# EasyEDA Pro project ProDoc_Eprobe_V3_1.epro, board 便携式电化学工作站V3_1
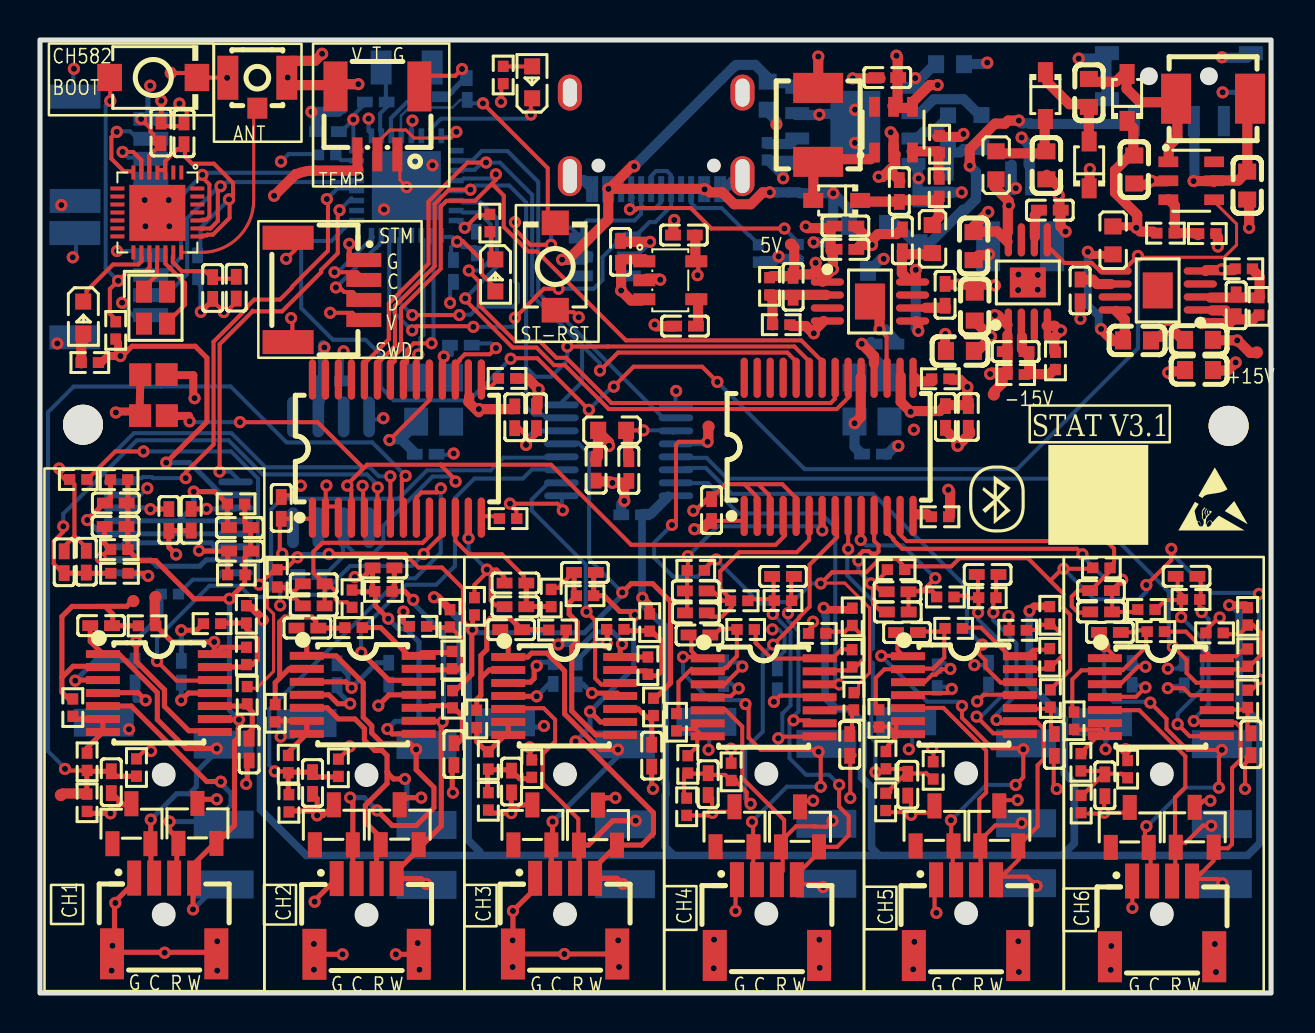
[diagram p6: board, top side]
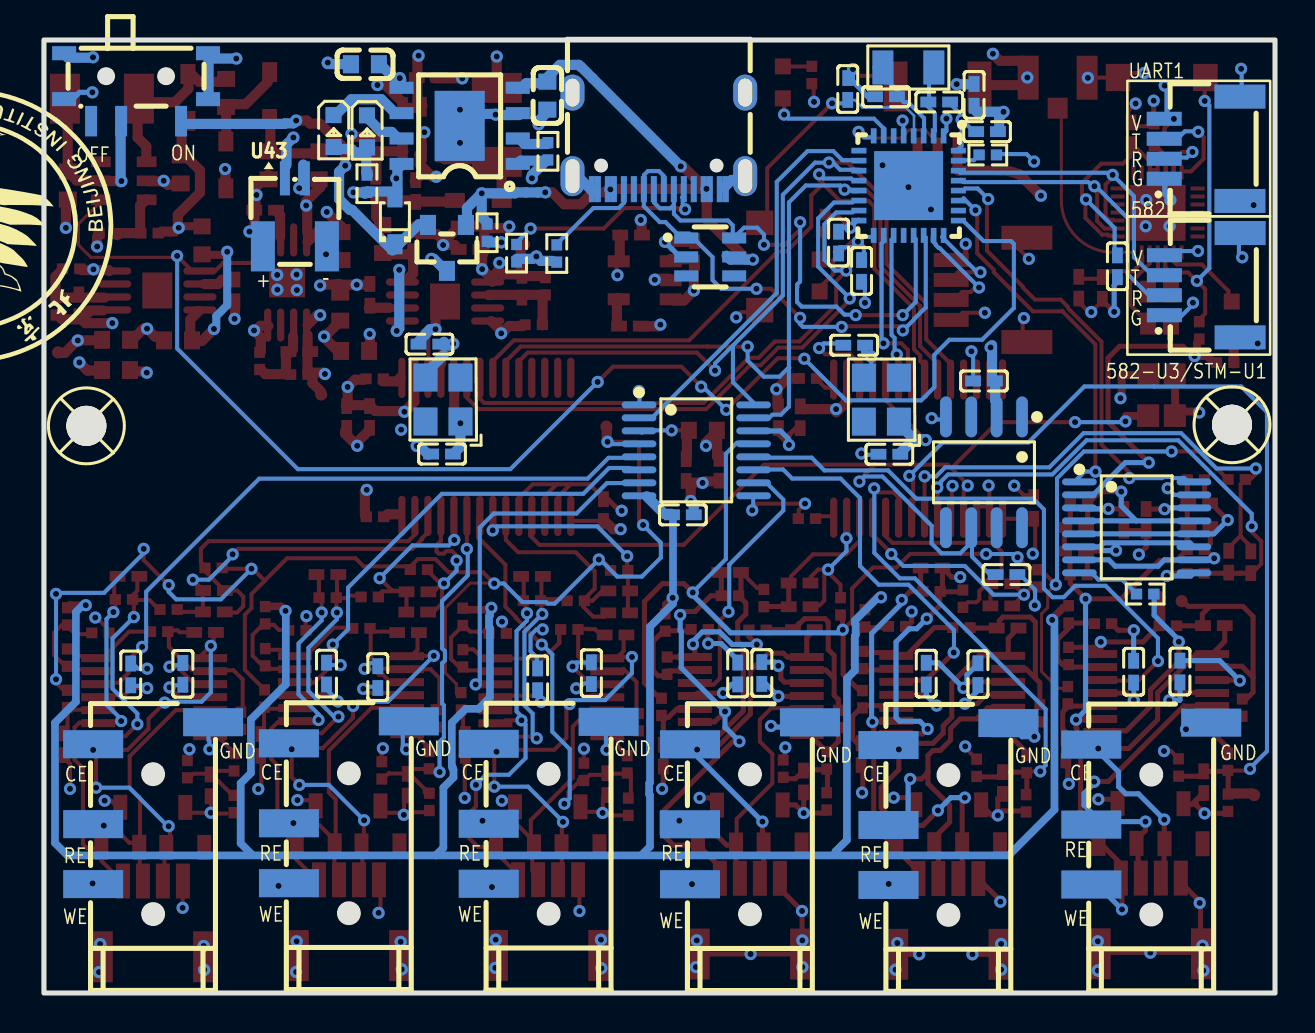
[diagram p7: board, bottom side, seen from below]

Outline 61.6 x 47.68 mm; copper layers: Top Layer, Inner1, Inner2, Bottom Layer. Coordinates in mm from the lower left corner of the outline.
Outline path: rectangle 0,47.68 61.6,0
Stack: Top Layer 0.035mm 外层铜厚1oz / Dielectric1 0.2104mm 7628 RC49% 8.6mil / Inner1 0.0152mm 内层铜厚 / Dielectric2 1.065mm 1.1mm H/HOZ Copper / Inner2 0.0152mm 内层铜厚 / Dielectric3 0.2104mm 7628 RC49% 8.6mil / Bottom Layer 0.035mm 外层铜厚1oz

## Design rules (mm)
net USB_DP: DP1
net USB_DM: DP1
net ADC2_AIN0: ADC2-3
net ADC2_AIN1: ADC2-3
net ADC2_AIN4: ADC2-2
net ADC2_AIN5: ADC2-2
net ADC2_AIN6: ADC2-1
net ADC2_AIN7: ADC2-1
net ADC1_AIN0: ADC1-3
net ADC1_AIN1: ADC1-3
net ADC1_AIN4: ADC1-2
net ADC1_AIN5: ADC1-2
net ADC1_AIN6: ADC1-1
net ADC1_AIN7: ADC1-1
template: JLCPCB Capability(Two Layers Board)
spacing copperThickness1oz (default): track to track 0.102, other pairs 0.152 to 0.3
spacing copperThickness2oz: track to track 0.203, other pairs 0.152 to 0.3
track width copperThickness1oz (default): min 0.127, default 0.254, max 2.54
track width copperThickness2oz: min 0.203, default 0.254, max 2.54
differential pair differentialPair (default): width min 0.127, default 0.254, max 2.54; gap min 0.152, default 0.152
via viaSize (default): diameter min 0.5, default 0.61, max 10; hole min 0.3, default 0.305, max 6.3

## Placement (name value [footprint] x y rotation side)
C1  2.2uF  [C0402]  7.89 36.36 90 bottom
C2  100nF  [C0402]  6.05 43.05 270 top
C3  100nF  [C0402]  7.21 43.02 90 top
C4  100nF  [C0402]  8.64 35.28 270 top
C5  2.2uF  [C0402]  9.82 35.29 270 top
C14  10nF  [C0402]  10.01 22.11 0 top
C15  22nF  [C0402]  3.79 24.52 0 top
C16  100nF  [C0402]  10 23.29 0 top
C17  10uF  [C0402]  27.82 26.18 90 top
C18  1uF  [C0402]  29.46 26.17 90 top
C19  220nF  [C0402]  29.63 23.93 0 bottom
C20  100nF  [C0402]  12.07 24.27 270 top
C21  33nF  [C0402]  2.32 21.58 90 top
C22  18pF  [C0402]  19.3 26.96 180 bottom
C23  18pF  [C0402]  21.06 32.41 180 bottom
C24  100nF  [C0402]  23.76 28.81 90 top
C27  100pF  [C0402]  1.21 21.55 90 top
C28  100nF  [C0402]  3.78 23.34 0 top
C31  100pF  [C0402]  3.06 18.38 180 top
C38  100nF  [C0402]  7.07 16.08 270 bottom
C40  100nF  [C0402]  4.76 16.09 270 bottom
C44  100nF  [C0402]  3.57 10.55 270 top
C45  12pF  [C0402]  16.8 44.58 0 bottom
C46  12pF  [C0402]  19.46 44.85 180 bottom
C47  100nF  [C0402]  21.38 45.23 270 bottom
C48  100nF  [C0402]  21.84 37.55 90 bottom
C49  4.7uF  [C0402]  20.69 36.13 270 bottom
C50  100nF  [C0402]  10.47 12.18 90 top
C51  100nF  [C0402]  7.57 23.68 270 top
C59  100nF  [C0402]  6.45 23.67 270 top
C60  33nF  [C0402]  13.69 19.37 180 top
C61  100pF  [C0402]  13.7 20.47 180 top
C62  100pF  [C0402]  13.38 18.26 180 top
C63  100nF  [C0402]  15.06 44.94 270 bottom
C64  100nF  [C0402]  14.41 43.1 0 bottom
C65  10uF  [C0402]  24.84 28.81 90 top
C72  18pF  [C0402]  41.68 26.97 180 bottom
C73  18pF  [C0402]  42.31 32.47 180 bottom
C74  100nF  [C0402]  45.31 28.82 90 top
C75  100nF  [C0402]  33.6 24.17 270 top
C76  100nF  [C0402]  14.56 30.62 180 bottom
C77  10uF  [C0402]  46.45 28.82 90 top
C84  100nF  [C0402]  17.45 15.98 270 bottom
C85  100nF  [C0402]  14.86 15.95 270 bottom
C86  100nF  [C0402]  13.64 10.51 270 top
C89  100nF  [C0402]  20.71 11.95 90 top
C96  100nF  [C0402]  17.19 21.27 0 top
C103  100pF  [C0402]  23.57 18.18 180 top
C104  100nF  [C0402]  26.88 15.99 270 bottom
C105  100nF  [C0402]  25.68 16.01 270 bottom
C106  100nF  [C0402]  23.59 10.58 270 top
C110  33nF  [C0402]  32.82 19.02 180 top
C111  100pF  [C0402]  32.81 20.12 180 top
C112  100pF  [C0402]  33 17.91 180 top
C113  100nF  [C0402]  36.89 15.7 270 bottom
C114  100nF  [C0402]  34.21 16 270 bottom
C115  100nF  [C0402]  33.43 10.45 270 top
C116  100nF  [C0402]  40.51 12.41 90 top
C117  100nF  [C0402]  37.18 20.84 0 top
C124  100pF  [C0402]  43.38 18.04 180 top
C125  100nF  [C0402]  47.46 15.98 270 bottom
C126  100nF  [C0402]  44.89 15.81 270 bottom
C127  100nF  [C0402]  43.42 10.42 270 top
C131  33nF  [C0402]  53.09 20.14 180 top
C132  100pF  [C0402]  53.09 19.07 180 top
C133  100pF  [C0402]  53.53 18.04 180 top
C134  100nF  [C0402]  57.25 15.94 270 bottom
C135  100nF  [C0402]  54.65 15.97 270 bottom
C136  100nF  [C0402]  53.28 10.39 270 top
C137  100nF  [C0402]  60.59 12.45 90 top
C138  100nF  [C0402]  57.37 20.85 0 top
C139  33nF  [C0402]  23.79 19.33 180 top
C140  100pF  [C0402]  23.79 20.51 180 top
C141  100nF  [C0402]  30.61 11.88 90 top
C142  100nF  [C0402]  27.27 21.04 0 top
C143  33nF  [C0402]  42.92 19.06 180 top
C144  100pF  [C0402]  42.91 20.08 180 top
C145  100nF  [C0402]  50.75 12.41 90 top
C146  100nF  [C0402]  47.41 20.94 0 top
C147  10uF  [C0402]  43 40.13 90 top
C148  10uF  [C0402]  43.15 37.66 90 top
C149  10uF  [C0402]  42.4 45.8 0 top
C150  10uF  [C0402]  40.3 37.21 0 top
C151  10uF  [C0402]  40.3 38.38 0 top
C152  10nF  [C0402]  45.29 34.93 90 top
C153  10nF  [C0402]  37.68 35.34 270 top
C154  10nF  [C0402]  32.28 33.37 0 top
C155  10nF  [C0402]  59.85 34.41 270 top
C156  10nF  [C0402]  52.04 35.16 90 top
C157  10nF  [C0402]  50.53 39.17 180 top
C158  10nF  [C0402]  48.82 32.1 180 top
C159  10uF  [C0603]  54.75 41.21 90 top
C160  10uF  [C0603]  60.4 40.4 270 top
C161  10uF  [C0603]  54.89 32.65 180 top
C162  10uF  [C0603]  52.48 45.04 270 top
C163  10uF  [C0603]  50.36 41.41 90 top
C164  10uF  [C0603]  46.71 37.37 270 top
C165  10uF  [C0603]  46.77 34.34 90 top
C166  10uF  [C0603]  46.03 32.13 180 top
C167  10uF  [C0603]  57.99 32.68 180 top
C168  10uF  [C0603]  57.99 31.17 180 top
C169  10uF  [C0603]  36.41 44.9 270 bottom
C170  10uF  [C0603]  45.54 46.47 0 bottom
C173  1uF  [C0402]  32.22 37.92 0 top
C174  1uF  [C0402]  29.05 37.08 270 top
C176  22uF  [C0402]  13.44 20.94 0 bottom
CN3  PJ-320D  [AUDIO-SMD_PJ-320D]  6.19 9.48 0 bottom
CN4  PJ-320D  [AUDIO-SMD_PJ-320D]  16.34 9.46 0 bottom
CN5  PJ-320D  [AUDIO-SMD_PJ-320D]  26.27 9.49 0 bottom
CN6  PJ-320D  [AUDIO-SMD_PJ-320D]  36.34 9.52 0 bottom
CN7  PJ-320D  [AUDIO-SMD_PJ-320D]  46.34 9.54 0 bottom
CN8  PJ-320D  [AUDIO-SMD_PJ-320D]  56.13 9.5 0 bottom
CN9  HC-1.0-4PWT  [CONN-SMD_4P-P1.00_HCTL_HC-1.0-4PWT]  6.21 3.86 0 top
CN10  HC-1.0-4PWT  [CONN-SMD_4P-P1.00_HCTL_HC-1.0-4PWT]  16.34 3.83 0 top
CN11  HC-1.0-4PWT  [CONN-SMD_4P-P1.00_HCTL_HC-1.0-4PWT]  26.27 3.85 0 top
CN12  HC-1.0-4PWT  [CONN-SMD_4P-P1.00_HCTL_HC-1.0-4PWT]  36.37 3.78 0 top
CN13  HC-1.0-4PWT  [CONN-SMD_4P-P1.00_HCTL_HC-1.0-4PWT]  46.34 3.77 0 top
CN14  HC-1.0-4PWT  [CONN-SMD_4P-P1.00_HCTL_HC-1.0-4PWT]  56.14 3.71 0 top
CN16  HC-1.0-4PWT  [CONN-SMD_4P-P1.00_HCTL_HC-1.0-4PWT]  14.31 35.18 270 top
CN17  HC-1.0-4PWT  [CONN-SMD_4P-P1.00_HCTL_HC-1.0-4PWT]  3.65 42.24 90 bottom
CN18  HC-1.0-4PWT  [CONN-SMD_4P-P1.00_HCTL_HC-1.0-4PWT]  3.64 35.41 90 bottom
D5  NUP2105LT1G  [SOT-23-3_L2.9-W1.3-P1.90-LS2.4-BR]  4.58 8.47 270 top
D6  NUP2105LT1G  [SOT-23-3_L2.9-W1.3-P1.90-LS2.4-BR]  7.88 8.49 270 top
D13  NUP2105LT1G  [SOT-23-3_L2.9-W1.3-P1.90-LS2.4-BR]  18 8.42 270 top
D14  NUP2105LT1G  [SOT-23-3_L2.9-W1.3-P1.90-LS2.4-BR]  14.7 8.42 270 top
D15  NUP2105LT1G  [SOT-23-3_L2.9-W1.3-P1.90-LS2.4-BR]  27.92 8.4 270 top
D16  NUP2105LT1G  [SOT-23-3_L2.9-W1.3-P1.90-LS2.4-BR]  24.64 8.41 270 top
D17  NUP2105LT1G  [SOT-23-3_L2.9-W1.3-P1.90-LS2.4-BR]  38.03 8.31 270 top
D18  NUP2105LT1G  [SOT-23-3_L2.9-W1.3-P1.90-LS2.4-BR]  34.75 8.32 270 top
D19  NUP2105LT1G  [SOT-23-3_L2.9-W1.3-P1.90-LS2.4-BR]  48 8.37 270 top
D20  NUP2105LT1G  [SOT-23-3_L2.9-W1.3-P1.90-LS2.4-BR]  44.76 8.36 270 top
D21  NUP2105LT1G  [SOT-23-3_L2.9-W1.3-P1.90-LS2.4-BR]  57.78 8.29 270 top
D22  NUP2105LT1G  [SOT-23-3_L2.9-W1.3-P1.90-LS2.4-BR]  54.53 8.29 270 top
D23  1N5819WS  [SOD-323_L1.8-W1.3-LS2.5-RD]  44.04 38.64 90 bottom
D24  1N5819WS  [SOD-323_L1.8-W1.3-LS2.5-RD]  39.86 39.66 180 top
D25  1N5819WS  [SOD-323_L1.8-W1.3-LS2.5-RD]  54.39 44.81 90 top
D26  1N5819WS  [SOD-323_L1.8-W1.3-LS2.5-RD]  50.31 44.9 270 top
D27  1N5819WS  [SOD-323_L1.8-W1.3-LS2.5-RD]  52.5 41.44 90 top
D28  SRV05-4  [SOT-23-6_L2.9-W1.6-P0.95-LS2.8-BL-1]  28.26 36.83 270 bottom
L1  BLM18AG601SN1D  [L0603]  28.63 28.15 0 top
L2  BLM18AG601SN1D  [L0603]  47.83 41.41 270 top
L4  BLM18AG601SN1D  [L0603]  53.69 37.66 270 top
L6  BLM18AG601SN1D  [L0603]  44.65 37.72 270 top
L9  10uH  [IND-SMD_L4.4-W4.2_BCIHP0412SC]  58.7 44.75 180 top
L10  10uH  [IND-SMD_L4.4-W4.2_BCIHP0412SC]  38.94 43.44 270 top
LED2  -  [LED_0603]  45.43 43.06 270 bottom
LED3  -  [LED_0603]  47.1 43.08 270 bottom
LED4  NCD0603G1  [LED0603-RD]  22.79 35.9 270 top
LED5  NCD0603B1  [LED0603-RD]  24.62 45.56 90 top
LED6  NCD0603G1  [LED0603-RD]  2.17 33.8 270 top
NOREF  -  [Pad_e1228]  1.05 9.91 0 top
NOREF#2  -  [Pad_e1258]  33.45 28.34 0 top
NOREF#3  -  [Pad_e5354]  5.02 30.94 0 top
NOREF#4  -  [Pad_e1216]  5.78 19.82 0 top
NOREF#5  -  [Pad_e5355]  5.01 28.89 0 top
NOREF#6  -  [Pad_e3832]  60.89 32.05 0 top
NOREF#7  -  [Pad_e1173]  47.73 29.95 0 top
NOREF#8  -  [Pad_e3816]  37.58 37.45 0 top
NOREF#9  -  [Pad_e5608]  6.35 28.89 0 top
NOREF#10  -  [Pad_e5607]  6.33 30.94 0 top
NOREF#11  -  [Pad_e3843]  4.67 19.61 0 top
Q1  AO3401A  [SOT-23_L2.9-W1.3-P1.90-LS2.4-BR]  41.43 37.28 90 bottom
R2  10kΩ  [R0402]  5.36 18.37 0 top
R3  10kΩ  [R0402]  1.64 14.28 270 top
R5  390K  [R0402]  48.82 30.95 180 top
R6  33K  [R0402]  50.81 31.63 270 top
R9  390K  [R0402]  61 34.36 270 top
R16  10kΩ  [R0402]  9.83 20.92 180 top
R17  3.1kΩ  [R0402]  3.96 25.69 180 top
R18  750Ω  [R0402]  9.81 24.48 180 top
R19  2kΩ  [R0402]  3.98 21 180 top
R20  2kΩ  [R0402]  1.92 25.69 180 top
R24  10kΩ  [R0402]  3.79 33.15 270 top
R26  100Ω  [R0402]  3.97 22.18 0 top
R27  10K  [R0402]  10.33 16.86 90 top
R28  3.9K  [R0402]  8.61 18.48 0 top
R29  2K  [R0402]  10.33 18.95 270 top
R30  2.2K  [R0402]  10.37 14.9 270 top
R39  5.1K  [R0402]  35.94 37 90 bottom
R40  5.1K  [R0402]  37.95 37.02 90 bottom
R41  5.1K  [R0402]  45.44 40.49 90 bottom
R42  2.2K  [R0402]  36.38 42.11 90 bottom
R43  10K  [R0402]  39.43 38.04 270 bottom
R49  4.7K  [R0402]  37.09 33.44 180 top
R50  15K  [R0402]  36.51 35.36 90 top
R53  10kΩ  [R0402]  15.69 18.28 0 top
R54  33kΩ  [R0402]  60.23 36.24 0 top
R55  10kΩ  [R0402]  11.77 14 270 top
R56  51kΩ  [R0402]  56.31 38.02 0 top
R57  2kΩ  [R0402]  58.41 38 0 top
R58  10kΩ  [R0402]  14.37 41.93 180 bottom
R59  10K  [R0402]  23.37 30.75 0 top
R60  10K  [R0402]  23.42 23.74 0 top
R61  33kΩ  [R0402]  45 40.29 90 top
R62  3.9kΩ  [R0402]  45.01 42.47 90 top
R63  2kΩ  [R0402]  15.62 19.73 270 top
R64  5.1kΩ  [R0402]  2.49 31.55 0 top
R65  10K  [R0402]  45.05 30.73 0 top
R66  10K  [R0402]  45.03 23.83 0 top
R87  2kΩ  [R0402]  11.87 20.74 270 top
R93  2.2K  [R0402]  20.64 14.7 270 top
R94  750Ω  [R0402]  17.18 20.09 180 top
R100  10kΩ  [R0402]  25.89 18.17 0 top
R103  10kΩ  [R0402]  21.85 13.71 270 top
R132  10kΩ  [R0402]  35.31 18.19 0 top
R133  10kΩ  [R0402]  31.85 13.55 270 top
R134  2kΩ  [R0402]  34.99 19.63 180 top
R135  2kΩ  [R0402]  32.81 21.15 180 top
R139  2.2K  [R0402]  40.72 14.6 270 top
R140  750Ω  [R0402]  37.18 19.64 180 top
R141  10kΩ  [R0402]  45.72 18.24 0 top
R142  10kΩ  [R0402]  41.98 13.74 270 top
R171  10kΩ  [R0402]  55.83 18.08 0 top
R172  10kΩ  [R0402]  51.74 13.62 270 top
R173  2kΩ  [R0402]  55.36 19.19 180 top
R174  2kΩ  [R0402]  53.11 21.27 0 top
R178  2.2K  [R0402]  60.43 14.72 270 top
R179  750Ω  [R0402]  57.6 19.69 180 top
R180  2kΩ  [R0402]  25.58 19.76 270 top
R181  2kΩ  [R0402]  21.74 19.35 90 top
R182  2.2K  [R0402]  30.7 14.32 270 top
R183  750Ω  [R0402]  27.27 19.88 180 top
R184  2kΩ  [R0402]  45.3 19.82 180 top
R185  2kΩ  [R0402]  42.84 21.19 180 top
R186  2.2K  [R0402]  50.56 14.73 270 top
R187  750Ω  [R0402]  47.4 19.78 180 top
R188  5.1kΩ  [R0402]  23.18 45.93 270 top
R189  5.1kΩ  [R0402]  22.51 38.52 90 top
R190  1kΩ  [R0402]  4.83 11.28 90 top
R191  10kΩ  [R0402]  2.36 11.57 90 top
R192  750Ω  [R0402]  2.36 9.52 90 top
R208  0  [R0402]  6.5 19.96 0 bottom
R212  1kΩ  [R0402]  14.93 11.27 90 top
R213  10kΩ  [R0402]  12.42 11.45 90 top
R214  750Ω  [R0402]  12.46 9.49 90 top
R218  1kΩ  [R0402]  24.61 11.23 90 top
R219  10kΩ  [R0402]  22.43 11.64 90 top
R220  750Ω  [R0402]  22.43 9.59 90 top
R224  1kΩ  [R0402]  34.58 11.07 90 top
R225  10kΩ  [R0402]  32.41 11.44 90 top
R226  750Ω  [R0402]  32.36 9.32 90 top
R230  1kΩ  [R0402]  54.42 11.2 90 top
R231  10kΩ  [R0402]  52.08 11.54 90 top
R232  750Ω  [R0402]  52.1 9.46 90 top
R236  1kΩ  [R0402]  44.69 11.14 90 top
R237  10kΩ  [R0402]  42.33 11.65 90 top
R238  750Ω  [R0402]  42.31 9.56 90 top
R239  10K  [R0402]  20.61 16.66 90 top
R240  3.9K  [R0402]  18.91 18.35 0 top
R241  2K  [R0402]  20.52 18.75 270 top
R242  10K  [R0402]  30.42 16.38 90 top
R243  3.9K  [R0402]  28.79 18.19 0 top
R244  2K  [R0402]  30.51 18.54 270 top
R245  10K  [R0402]  40.63 16.75 90 top
R246  3.9K  [R0402]  38.89 17.99 0 top
R247  2K  [R0402]  40.64 18.82 270 top
R248  10K  [R0402]  50.52 16.8 90 top
R249  3.9K  [R0402]  48.92 18.15 0 top
R250  2K  [R0402]  50.53 18.9 270 top
R251  10K  [R0402]  60.44 16.78 90 top
R252  3.9K  [R0402]  58.77 18.02 0 top
R253  2K  [R0402]  60.43 18.85 270 top
SW1  TS-1088R-02026  [SW-SMD_L3.9-W3.0-P4.45]  25.78 36.35 90 top
SW3  MSK12C02  [SW-TH_MSK12C02]  56.99 45.32 0 bottom
SW4  TS-1088-AR02016  [SW-SMD_L3.9-W3.0-P4.45]  5.67 45.81 0 top
TP1  -  [M2螺丝]  59.47 28.38 180 bottom
TP2  -  [M2螺丝]  2.15 28.43 180 bottom
U1  CH582F  [QFN-28_L4.0-W4.0-P0.40-BL-EP2.8]  5.87 39.05 180 top
U2  STM32L432KCU6  [UFQFPN-32_L5.0-W5.0-P0.50-TL-EP3.5]  18.33 40.4 270 bottom
U3  DAC8568ICPWR  [TSSOP-16_L5.0-W4.4-P0.65-LS6.4-BL]  28.96 27.15 270 bottom
U4  DG409DQ-T1-E3  [TSSOP-16_L5.0-W4.4-P0.65-LS6.4-BL]  6.92 23.3 270 bottom
U6  OPA4197QPWRQ1  [TSSOP-14_L5.0-W4.4-P0.65-LS6.4-BL]  16.15 14.92 270 top
U7  OPA4197QPWRQ1  [TSSOP-14_L5.0-W4.4-P0.65-LS6.4-BL]  5.95 15.01 270 top
U8  OPA4197QPWRQ1  [TSSOP-14_L5.0-W4.4-P0.65-LS6.4-BL]  26.23 14.86 270 top
U9  OPA4197QPWRQ1  [TSSOP-14_L5.0-W4.4-P0.65-LS6.4-BL]  46.23 14.9 270 top
U12  TP4056  [ESOP-8_L4.9-W3.9-P1.27-LS6.0-BL-EP]  40.8 43.39 90 bottom
U15  SGM2036-3.3YN5G/TR  [SOT-23-5_L3.0-W1.7-P0.95-LS2.8-BR]  31.54 35.66 180 top
U16  OPA4197QPWRQ1  [TSSOP-14_L5.0-W4.4-P0.65-LS6.4-BL]  36.21 14.8 270 top
U20  ADS1256IDBR  [SSOP-28_L10.2-W5.3-P0.65-LS7.8-BL]  17.86 27.24 0 top
U21  -  [JLC-QRCODE-5x5]  52.95 24.92 270 top
U22  MT3608L  [SOT-23-6_L2.9-W1.7-P0.95-LS2.8-BL]  57.6 40.64 270 top
U25  TPS7A4901DGNT  [MSOP-8_L3.0-W3.0-P0.65-LS4.9-BL-EP1.8]  55.93 35.15 90 top
U26  TPS7A4901DGNT  [MSOP-8_L3.0-W3.0-P0.65-LS4.9-BL-EP1.8]  41.53 34.6 270 top
U27  MT3608L  [SOT-23-6_L2.9-W1.7-P0.95-LS2.8-BL]  42.71 43.2 0 top
U28  TPS7A3001DGNR  [MSOP-8_L3.0-W3.0-P0.65-LS5.0-BL-EP]  49.43 35.55 0 top
U29  BWU.FL-IPEX1  [IPEX-SMD_BWIPX-1-001E]  10.88 45.03 90 top
U30  ADS1256IDBR  [SSOP-28_L10.2-W5.3-P0.65-LS7.8-BL]  39.46 27.33 0 top
U31  REF5025AIDR  [SOIC-8_L4.9-W3.9-P1.27-LS6.0-BL]  14.56 26.05 0 bottom
U41  OPA4197QPWRQ1  [TSSOP-14_L5.0-W4.4-P0.65-LS6.4-BL]  56.08 14.8 270 top
U42  32MHz  [CRYSTAL-SMD_4P-L2.0-W1.6-BL-2]  5.78 34.29 270 top
U43  WAFER-SH1.0-2PWB  [CONN-SMD_2P-P1.00_XUNPU_WAFER-SH1.0-2PWB]  49.04 39.06 180 bottom
U44  WAFER-SH1.0-3PWB  [CONN-SMD_3P-P1.00_WAFER-SH1.0-3PWB]  16.89 43.66 180 top
USB1  KH-TYPE-C-16P  [USB-C-SMD_KH-TYPE-C-16P]  30.83 42.64 0 bottom
X5  8MHz  [OSC-SMD_4P-L3.2-W2.5-BL]  19.7 29.69 90 bottom
X6  32.768kHz  [OSC-SMD_L3.2-W1.5]  18.35 46.31 180 bottom
X7  8MHz  [OSC-SMD_4P-L3.2-W2.5-BL]  41.63 29.69 90 bottom

## Footprints (pads in the part's own frame, mm; a bottom-side part is the same pattern mirrored in y, then rotated)
AUDIO-SMD_PJ-320D
  rect 3x1.4 smd: 1(-3,-4.05) 2(3,4.05) 3(3,1.05) 4(3,-2.95)
C0402
  rect 0.79x0.54 smd: 1(-0.545,0) 2(0.545,0)
C0603
  rect 0.8x0.9 smd: 1(-0.7,0) 2(0.7,0)
CONN-SMD_2P-P1.00_XUNPU_WAFER-SH1.0-2PWB
  rect 0.5x1.7 smd: 1(-0.5,1.7) 2(0.5,1.7)
  rect 1.2x2.5 smd: 3(1.6,-1.7) 4(-1.6,-1.7)
CONN-SMD_3P-P1.00_WAFER-SH1.0-3PWB
  rect 0.5x1.7 smd: 1(-1,1.7) 2(0,1.7) 3(1,1.7)
  rect 1.2x2.5 smd: 4(-2.1,-1.7) 5(2.1,-1.7)
CONN-SMD_4P-P1.00_HCTL_HC-1.0-4PWT
  rect 0.7x1.75 smd: 1(-1.5,1.895) 2(-0.5,1.895) 3(0.5,1.895) 4(1.5,1.895)
  rect 1.2x2.55 smd: 5(2.61,-1.895) 6(-2.61,-1.895)
CRYSTAL-SMD_4P-L2.0-W1.6-BL-2
  rect 1.1x0.8 smd: 1(-0.8,-0.575) 2(0.8,-0.575) 3(0.8,0.575) 4(-0.8,0.575)
ESOP-8_L4.9-W3.9-P1.27-LS6.0-BL-EP
  rect 0.6x1.199 smd: 1(-1.905,-2.909) 2(-0.635,-2.909) 3(0.635,-2.909) 4(1.905,-2.909) 5(1.905,2.909) 6(0.635,2.909) 7(-0.635,2.909) 8(-1.905,2.909)
  rect 3.5x2.499 smd: 9(0,0)
IND-SMD_L4.4-W4.2_BCIHP0412SC
  rect 1.5x2.5 smd: 1(-1.85,0) 2(1.85,0)
IPEX-SMD_BWIPX-1-001E
  rect 1.05x1 smd: 1(-0.762,0)
  rect 2.2x1.05 smd: 2(0.762,-1.475) 3(0.762,1.475)
L0603
  rect 0.8x0.864 smd: 1(-0.7,0) 2(0.7,0)
LED0603-RD
  rect 0.8x0.8 smd: 1(-0.799,0) 2(0.799,0)
LED_0603
  rect 0.8x0.8 smd: 1(-0.851,-0.01) 2(0.75,-0.005)
M2螺丝
  round 2 hole 2: 1(0,0)
MSOP-8_L3.0-W3.0-P0.65-LS4.9-BL-EP1.8
  oval 0.364x1.662 smd: 1(-0.975,-2.131) 2(-0.325,-2.131) 3(0.325,-2.131) 4(0.975,-2.131) 5(0.975,2.131) 6(0.325,2.131) 7(-0.325,2.131) 8(-0.975,2.131)
  rect 1.8x1.5 smd: 9(0,0)
MSOP-8_L3.0-W3.0-P0.65-LS5.0-BL-EP
  oval 0.364x1.662 smd: 1(-0.975,-2.131) 2(-0.325,-2.131) 3(0.325,-2.131) 4(0.975,-2.131) 5(0.975,2.131) 6(0.325,2.131) 7(-0.325,2.131) 8(-0.975,2.131)
  rect 1.8x1.5 smd: 9(0,0)
OSC-SMD_4P-L3.2-W2.5-BL
  rect 1.4x1.2 smd: 1(-1.1,-0.875) 2(1.1,-0.875) 3(1.1,0.875) 4(-1.1,0.875)
OSC-SMD_L3.2-W1.5
  rect 1.05x1.7 smd: 1(-1.275,0) 2(1.275,0)
Pad_e1173
  round 0.61 smd: TP1(0,0)
Pad_e1216
  round 0.61 smd: TP3(0,0)
Pad_e1228
  round 0.61 smd: TP4(0,0)
Pad_e1258
  round 0.61 smd: TP5(0,0)
Pad_e3816
  round 0.61 smd: TP2(0,0)
Pad_e3832
  round 0.61 smd: TP3(0,0)
Pad_e3843
  round 0.61 smd: TP4(0,0)
Pad_e5354
  custom 1.105x1.136 smd: 1(0,0)
Pad_e5355
  custom 1.105x1.136 smd: 1(0,0)
Pad_e5607
  custom 1.105x1.136 smd: 1(0,0)
Pad_e5608
  custom 1.105x1.136 smd: 1(0,0)
QFN-28_L4.0-W4.0-P0.40-BL-EP2.8
  rect 0.2x0.7 smd: 1(-1.2,-2) 2(-0.8,-2) 3(-0.4,-2) 4(-0.001,-2) 5(0.4,-2) 6(0.8,-2) 7(1.2,-2) 15(1.2,2) 16(0.8,2) 17(0.4,2) 18(0,2) 19(-0.4,2) 20(-0.8,2) 21(-1.2,2)
  rect 0.7x0.2 smd: 8(2,-1.2) 9(2,-0.8) 10(2,-0.4) 11(1.999,0) 12(2,0.4) 13(2,0.8) 14(2,1.2) 22(-2,1.2) 23(-2,0.8) 24(-2,0.4) 25(-2,0) 26(-2,-0.4) 27(-2,-0.8) 28(-2,-1.2)
  rect 2.8x2.8 smd: 29(0.001,0.02)
R0402
  rect 0.566x0.54 smd: 1(-0.433,0) 2(0.433,0)
SOD-323_L1.8-W1.3-LS2.5-RD
  rect 1x0.75 smd: 1(-1.173,0) 2(1.173,0)
SOIC-8_L4.9-W3.9-P1.27-LS6.0-BL
  oval 0.588x2.045 smd: 1(-1.905,-2.772) 2(-0.635,-2.772) 3(0.635,-2.772) 4(1.905,-2.772) 5(1.905,2.772) 6(0.635,2.772) 7(-0.635,2.772) 8(-1.905,2.772)
SOT-23-3_L2.9-W1.3-P1.90-LS2.4-BR
  rect 1.25x0.7 smd: 1(1,-0.95) 2(1,0.95) 3(-1,0)
SOT-23-5_L3.0-W1.7-P0.95-LS2.8-BR
  rect 1.1x0.6 smd: 1(1.3,-0.95) 2(1.3,0) 3(1.3,0.95) 4(-1.3,0.95) 5(-1.3,-0.95)
SOT-23-6_L2.9-W1.6-P0.95-LS2.8-BL-1
  rect 0.55x1.2 smd: 1(-0.95,-1.2) 2(0,-1.2) 3(0.95,-1.2) 4(0.95,1.2) 5(0,1.2) 6(-0.95,1.2)
SOT-23-6_L2.9-W1.7-P0.95-LS2.8-BL
  rect 0.532x0.99 smd: 1(-0.95,-1.145) 2(0,-1.145) 3(0.95,-1.145) 4(0.95,1.145) 5(0,1.145) 6(-0.95,1.145)
SOT-23_L2.9-W1.3-P1.90-LS2.4-BR
  rect 1x0.8 smd: 1(1.15,-0.95) 2(1.15,0.95) 3(-1.15,0)
SSOP-28_L10.2-W5.3-P0.65-LS7.8-BL
  oval 0.364x2.015 smd: 1(-4.225,-3.455) 2(-3.575,-3.455) 3(-2.925,-3.455) 4(-2.275,-3.455) 5(-1.625,-3.455) 6(-0.975,-3.455) 7(-0.325,-3.455) 8(0.325,-3.455) 9(0.975,-3.455) 10(1.625,-3.455) 11(2.275,-3.455) 12(2.925,-3.455) 13(3.575,-3.455) 14(4.225,-3.455) 15(4.225,3.455) 16(3.575,3.455) 17(2.925,3.455) 18(2.275,3.455) 19(1.625,3.455) 20(0.975,3.455) 21(0.325,3.455) 22(-0.325,3.455) 23(-0.975,3.455) 24(-1.625,3.455) 25(-2.275,3.455) 26(-2.925,3.455) 27(-3.575,3.455) 28(-4.225,3.455)
SW-SMD_L3.9-W3.0-P4.45
  rect 1.23x1.36 smd: 1(-2.185,0) 2(2.185,0)
SW-TH_MSK12C02
  rect 0.6x1.524 smd: 1(-2.25,1.7) 2(0.75,1.7) 3(2.25,1.7)
  rect 1.2x0.7 smd: 4(-3.6,-1.7) 4(-3.6,0.6) 4(3.6,-1.7) 4(3.6,0.6)
TSSOP-14_L5.0-W4.4-P0.65-LS6.4-BL
  rect 0.4x1.7 smd: 1(-1.95,-2.8) 2(-1.3,-2.8) 3(-0.65,-2.8) 4(0,-2.8) 5(0.65,-2.8) 6(1.3,-2.8) 7(1.95,-2.8) 8(1.95,2.8) 9(1.3,2.8) 10(0.65,2.8) 11(0,2.8) 12(-0.65,2.8) 13(-1.3,2.8) 14(-1.95,2.8)
TSSOP-16_L5.0-W4.4-P0.65-LS6.4-BL
  oval 0.343x1.732 smd: 1(-2.275,-2.866) 2(-1.625,-2.866) 3(-0.975,-2.866) 4(-0.325,-2.866) 5(0.325,-2.866) 6(0.975,-2.866) 7(1.625,-2.866) 8(2.275,-2.866) 9(2.275,2.866) 10(1.625,2.866) 11(0.975,2.866) 12(0.325,2.866) 13(-0.325,2.866) 14(-0.975,2.866) 15(-1.625,2.866) 16(-2.275,2.866)
UFQFPN-32_L5.0-W5.0-P0.50-TL-EP3.5
  rect 0.75x0.28 smd: 1(-2.49,1.75) 2(-2.49,1.25) 3(-2.49,0.75) 4(-2.49,0.25) 5(-2.49,-0.25) 6(-2.49,-0.75) 7(-2.49,-1.25) 8(-2.49,-1.75) 17(2.49,-1.75) 18(2.49,-1.25) 19(2.49,-0.75) 20(2.49,-0.25) 21(2.49,0.25) 22(2.49,0.75) 23(2.49,1.25) 24(2.49,1.75)
  rect 0.28x0.75 smd: 9(-1.75,-2.49) 10(-1.25,-2.49) 11(-0.75,-2.49) 12(-0.25,-2.49) 13(0.25,-2.49) 14(0.75,-2.49) 15(1.25,-2.49) 16(1.75,-2.49) 25(1.75,2.49) 26(1.25,2.49) 27(0.75,2.49) 28(0.25,2.49) 29(-0.25,2.49) 30(-0.75,2.49) 31(-1.25,2.49) 32(-1.75,2.49)
  rect 3.45x3.45 smd: 33(0,0)
USB-C-SMD_KH-TYPE-C-16P
  oval 1.2x2 hole 0.7x1.7: 1(-4.32,1.765) 2(4.32,1.765)
  oval 1.2x1.8 hole 0.7x1.4: 3(-4.32,-2.415) 4(4.32,-2.415)
  rect 0.3x1.3 smd: A1(-3.35,2.415) A4(-2.55,2.415) A5(-1.25,2.415) A6(-0.25,2.415) A7(0.25,2.415) A8(1.25,2.415) A9(2.55,2.415) A12(3.35,2.415) B1(3.05,2.415) B4(2.25,2.415) B5(1.75,2.415) B6(0.75,2.415) B7(-0.75,2.415) B8(-1.75,2.415) B9(-2.25,2.415) B12(-3.05,2.415)

## Nets
As in the schematic, except:
5V: C17.2 C20.2 C75.2 C76.2 C150.1 C151.1 C153.1 L1.1 NOREF#8.TP2 NOREF#10.1 R50.2 U20.1 U26.1 U30.1 U31.2
+15V: C40.2 C59.1 C85.2 C105.2 C114.2 C126.2 C135.2 C155.2 C167.1 C168.1 NOREF#6.TP3 R9.2 U4.14 U6.4 U7.4 U8.4 U9.4 U16.4 U25.1 U41.4
-15V: C38.2 C51.1 C84.2 C104.2 C113.2 C125.2 C134.2 C158.2 C165.1 C166.1 NOREF#7.TP1 R5.2 U4.3 U6.11 U7.11 U8.11 U9.11 U16.11 U28.1 U41.11
ADC2_AIN2: C44.1 NOREF.TP4 R190.1 R191.1 R192.2 U20.8
DAC_VOUTA: NOREF#2.TP5 R135.1 R139.1 R174.1 R178.1 R185.1 R186.1 U3.4
TIA_REF: NOREF#3.1 NOREF#5.1 R190.2 R212.2 R218.2 R224.2 R230.2 R236.2
VREF2.5V: C176.2 NOREF#9.1 U20.4 U30.4 U31.6
$9N5267: C31.1 NOREF#11.TP4 R2.1 R3.1 U7.2
$9N5378: NOREF#4.TP3 R2.2 R27.2 U7.14

Pads without a net: D5 1; D14 1; D16 1; D18 1; D20 1; D22 1; D28 3 4; SW3 3; U1 1 2 8 9 10 11 12 13 14 15 25 26 27 28; U2 6 9 20 26; U20 25 26 27 28; U22 6; U25 3 7; U26 3 7; U27 6; U28 3 7; U30 25 26 27 28; U31 1 3 5 7 8; U42 2 4; USB1 A8 B8; X5 2 4; X7 2 4

## Via types
v1: diameter 0.61, hole 0.305, Top Layer to Bottom Layer, 410 vias

## Routing (per net, layer and track width the routed paths; a pad name or vN(x,y) marks a point on that pad's centre or on a via; arc(x,y) is an arc through that point)
3V3: length 61
  Top Layer w0.203: 22.67,35.41 22.11,35.97 22.11,36.67 21.7,37.07 ; 23.83,23.71 23.83,24.17 v1(23.52,24.49) ; 23.08,45.52 23.08,44.61 v1(23.07,44.59) ; 21.7,37.07 21.71,37.07 ; 21.7,37.07 21.15,37.63 20.86,37.63 ; 21.47,30.36 21.47,29.85 ; 23.54,24.48 25.89,24.48 26.22,24.15 ; 16.08,33.58 15.63,34.04 v1(14.52,34.04) ; v1(32.9,35.91) 32.94,35.95 32.94,36.53 ; 5.86,42.39 5.67,42.58 5.67,42.96 5.53,43.1 5.53,43.26 v1(5.06,43.73) ; 6.08,42.5 5.47,41.89 5.47,41.03
  Top Layer w0.254: 3.9,32.02 4.26,32.02 4.61,32.36 7.77,32.36 8.35,31.78 8.35,28.58 v1(6.32,26.54)
  Top Layer w0.4: 3.98,31.87 3.4,31.87 3,31.47 ; 3.98,31.87 v1(4.03,31.87) ; 3.98,31.87 3.87,31.98 3.9,32.02 3.9,32.53
  Top Layer w0.508: 24.93,30.21 24.9,30.17 24.9,29.33 ; 45.25,29.41 46.4,29.41 ; 46.4,29.41 46.47,29.41 46.49,29.39 ; 46.4,29.41 v1(46.4,30.32) ; 24.94,30.22 24.41,30.74 23.82,30.74 ; 23.69,29.22 21.95,29.22 ; v1(11.71,39.89) 12.8,40.98 12.86,40.98 arc(13.3,41.11) 13.76,41.15 15.83,41.15 15.92,41.24 ; 32.87,36.61 32.79,36.7 32.79,37.95 ; 21.95,29.05 21.43,29.58 ; 21.47,29.85 21.47,29.58 ; 23.78,29.33 23.69,29.24 ; 45.3,29.39 45.02,29.12 43.58,29.12 ; 45.55,30.69 46.03,30.69 46.33,30.39 ; v1(43.56,29.08) 43.06,29.58 43.06,30.87 ; 45.54,23.88 45.54,25.08 v1(45.45,25.18)
  Bottom Layer w0.203: 5.39,36.97 5.23,37.13 v1(3.85,37.13) ; v1(20.87,37.59) 21.14,37.32 21.77,37.32 22.02,37.06 ; 26.11,24.84 26.11,24.2 v1(26.16,24.15) ; 20.86,37.61 20.57,37.32 20.57,36.78 ; 20.86,37.61 20.63,37.83 20.11,37.83 ; 20.86,37.61 20.88,37.63 ; v1(16.44,43.75) 16.44,43.13 16.57,43.01 16.61,43.01 ; v1(18.64,43.65) 18.59,43.61 18.59,43.08
  Bottom Layer w0.254: 9.42,24.95 9.07,24.95 8.67,25.35 8.67,25.36 7.49,26.54 v1(6.32,26.54) ; v1(5.52,45.4) 5.4,45.28 5.4,43.79
  Bottom Layer w0.508: 13.8,43.2 13.8,43.82 13.6,44.02 ; 13.59,44.09 13.58,44.09 ; 13.6,44.09 14.93,44.09 15.01,44.18
  vias: v1(13.58,44.09) v1(21.96,29.22) v1(24.95,30.21) v1(43.73,28.19)
5V: length 22.8
  Top Layer w0.203: 35.18,23.67 35.14,23.62 33.54,23.62 ; v1(12.12,21.98) 12,22.1 12,23.65 ; 12.08,23.88 12.23,23.73 13.56,23.73
  Top Layer w0.4: 7.67,29.82 7.67,30.91 6.35,30.91
  Top Layer w0.508: v1(28.47,27.38) 28.47,27.55 27.92,28.1 27.92,26.84 27.76,26.69 ; 39.56,38.33 39.56,38.27 ; 39.56,38.27 39.56,37.15 39.58,37.13 ; 39.56,38.27 38.4,38.27 v1(38.32,38.35) ; 39.56,38.27 39.62,38.27 ; 37.74,35.96 37.7,35.96 37.61,35.87 36.59,35.87 ; 37.74,35.96 37.74,37.32 37.64,37.42 ; 37.74,35.96 37.74,35.92 ; 37.74,35.96 38.63,35.96 38.84,36.16 ; 38.84,36.16 39.12,35.87 39.16,35.61 ; 38.84,36.16 38.84,36.51 v1(38.81,36.53) ; 39.64,36.91 39.67,36.88 v1(39.67,36.22) 39.16,35.7 39.16,35.61 ; v1(32.74,23.21) 33.13,23.21 33.54,23.62 ; 39.16,35.59 39.16,35.61
  Bottom Layer w0.203: 14.01,30.66 13.92,30.57
  Bottom Layer w0.508: 13.92,29.58 14,29.66 14,30.6 ; 14.16,32.42 14.16,30.78 ; 14.14,30.8 14.01,30.66
  vias: v1(7.73,29.76) v1(14.23,32.3)
15.8V: length 8.4
  Top Layer w0.4: v1(52.43,37.09) 52.58,36.93 53.6,36.93 53.66,36.87
  Top Layer w0.508: 54.28,32.57 54.28,33.7 53.84,34.13 ; 54.15,32.62 53.69,32.62 v1(53.09,33.22)
  Bottom Layer w0.4: 52.97,33.28 52.97,33.87 52.43,34.41 v1(52.43,37.09)
+15V: length 27
  Top Layer w0.203: 53.75,14.82 54.84,14.82 v1(55.31,15.29) ; 33.76,14.86 34.58,14.86 v1(34.96,15.24) ; 43.96,15.01 45.16,15.01 45.17,15.02 45.42,15.02 v1(45.62,15.22)
  Top Layer w0.254: v1(5.52,24.21) 5.53,24.21 C59.1 ; v1(15.52,14.48) 14.9,14.48 14.45,14.92 U6.4 ; U8.4 23.45,14.85 v1(24.85,14.85) ; v1(5.29,14.65) 4.91,15.03 3.17,15.03 U7.4
  Top Layer w0.508: 60.86,32.03 60.55,32.03 59.94,32.64 ; 59.71,33.71 60.7,33.71 60.85,33.85 ; 59.71,33.71 59.52,33.52 v1(58.18,33.52) ; 59.71,33.71 59.29,34.12 ; 58.65,34.16 59.32,34.16 ; 59.87,32.66 58.73,32.66 ; v1(59.83,31.55) 59.42,31.14 58.85,31.14
  Bottom Layer w0.203: 54.72,15.4 55.25,15.4 55.42,15.23 ; 34.91,15.16 34.59,15.49 34.17,15.49 ; 44.88,15.32 45.52,15.32 45.61,15.24
  Bottom Layer w0.254: v1(15.52,14.48) 14.86,15.13 14.86,15.41 ; U4.14 5.46,24.27 v1(5.52,24.21) ; v1(24.85,14.85) 25.47,15.47 C105.2 ; v1(5.29,14.65) 4.78,14.65 4.76,14.67 C40.2
  vias: v1(59.9,32.65)
-15.8V: length 6
  Top Layer w0.508: v1(47.45,39.08) 46.73,38.36 46.73,38.2 ; 46.73,38.1 47.9,38.1 48.41,37.58 ; 47.84,40.59 47.76,40.51 47.76,40.33 48.48,39.61 v1(48.48,39.41) 48.43,39.35 48.43,38.05
-15V: length 27.1
  Top Layer w0.203: 49.39,14.93 47.23,14.93 v1(46.89,14.59) ; 39.43,14.88 37.03,14.88 v1(36.72,14.57) ; 58.36,14.9 57.56,14.9 57.21,15.25 v1(56.43,15.25)
  Top Layer w0.254: v1(7.07,14.65) 7.43,15.01 8.75,15.01 ; v1(27.62,15.01) 28.89,15.01 U8.11 ; v1(16.93,14.38) 17.47,14.92 U6.11 ; C51.1 v1(8.34,24.22)
  Top Layer w0.508: 47.61,32.83 46.94,32.16 46.74,32.16 ; 48.16,30.92 48.16,30.52 47.74,30.1 ; 47.76,33.91 47.93,33.91 48.41,33.43 ; 46.84,33.55 47.54,32.85 v1(47.58,32.85) ; 48.42,31.04 48.41,31.04 ; 48.41,31.04 48.41,32.06 ; 48.41,31.04 47.61,31.04 v1(47.54,30.97) ; 48.41,32.92 48.41,32.09
  Bottom Layer w0.203: 57.2,15.37 56.56,15.37 56.44,15.25 ; 47.52,15.26 46.89,14.63 46.89,14.56
  Bottom Layer w0.254: 26.76,15.44 27.18,15.44 v1(27.62,15.01) ; 9.79,24.27 9.74,24.22 v1(8.34,24.22) ; C84.2 17.45,14.9 v1(16.93,14.38) ; C38.2 7.07,15.52 v1(7.07,14.65)
  Bottom Layer w0.508: v1(47.78,33.92) 47.78,33.91
GND: length 238.9
  Top Layer w0.152: 18.01,41.66 18.01,40.68 18.31,40.38
  Top Layer w0.203: 32.45,8.89 33.51,8.89 ; 9.06,45.8 7.95,45.8 7.9,45.76 ; v1(22.81,32.27) 22.5,31.96 21.25,31.96 21,31.7 21,31.64 20.78,31.42 20.78,31.33 ; 40.76,11.91 40.54,11.69 v1(40.54,9.76) ; 12.63,32.52 12.63,33.71 v1(12.57,33.77) ; v1(58.56,9.62) 58.24,9.62 57.89,9.27 ; v1(38.68,18.58) 38.68,18.4 38.49,18.21 ; 44.76,5.72 44.76,4.11 v1(44.85,4.01) ; v1(38.69,9.62) 38.65,9.59 38.18,9.59 ; 25.81,34.07 26.7,34.07 v1(26.96,33.81) ; 14.3,24.42 14.3,25.35 v1(14.33,25.39) ; 48.12,9.44 48.33,9.65 v1(48.91,9.65) ; v1(16.14,25.38) 16.17,25.34 16.17,24.42 ; 43.58,9.88 43.58,8.99 ; 35.94,25.46 37.14,25.46 37.84,24.76 ; 35.94,25.46 36.47,24.93 36.47,24.7 ; 35.94,25.46 35.25,25.46 ; 33.71,24.87 34.3,25.46 35.25,25.46 ; 43.46,9.05 42.61,9.05 ; 50.72,11.87 50.72,10.36 v1(50.87,10.21) ; 35.25,25.46 35.82,24.89 35.82,24.59 ; 53.95,15.47 54.08,15.47 54.93,16.33 v1(55.31,16.33) ; 48.51,18.18 48.51,18.81 v1(48.46,18.86) ; 54.6,5.62 54.66,5.57 v1(54.66,4.26) ; 7.26,43.37 6.28,43.37 6,43.65 ; 22.46,38.92 21.9,38.92 21.25,38.27 ; v1(6.54,46.03) 7.99,46.03 8.2,46.24 ; 33.63,9.01 33.63,9.07 ; 33.63,9.07 34.6,9.07 34.76,9.22 ; 33.63,9.07 33.63,9.76 33.53,9.85 ; v1(53.25,9.02) 53.25,9.03 53.25,9.81 53.25,9.82 ; v1(13.05,25.38) 12.57,24.9 12.05,24.9 ; 14.74,45.81 14.51,46.04 14.51,46.18 ; 53.28,9.02 54.46,9.02 ; 34.09,15.45 34.25,15.45 v1(35.14,16.34) ; 44.83,9.17 44.68,9.02 43.65,9.02 ; 42.36,31.15 42.36,32.83 42.04,33.16 ; 9.74,34.5 9.31,34.07 ; 8.63,34.65 9.16,34.12 ; 43.97,15.48 44.19,15.48 44.64,15.93 44.82,15.93 45.09,16.2 45.56,16.2 ; 34.8,5.09 v1(34.8,4.1) ; 19.02,45.9 20.77,45.89 v1(21.12,46.23) ; v1(59.03,18.79) 58.97,18.79 58.31,18.13 ; v1(60.29,10.22) 60.29,11.47 60.37,11.55 60.37,11.83 60.44,11.89 ; 52.45,8.98 53.24,8.98 ; v1(6.98,44.5) 7.34,44.14 7.34,43.42 ; 14.97,24.5 14.82,24.34 14.23,24.34 ; v1(12.32,36.73) 12.86,37.27 12.86,37.62 ; 9.72,34.67 9.73,34.68
  Top Layer w0.254: D14.3 14.17,8.89 v1(13.87,8.89) ; v1(19.08,9.78) 18.35,9.78 D13.3 ; D15.3 28.28,9.77 v1(28.79,9.77) ; 3.94,9.66 4.17,9.43 4.6,9.43 4.78,9.61 ; 3.94,9.66 3.65,9.95 ; 3.94,9.66 3.94,9.41 v1(3.53,8.99) 2.47,8.99 2.34,9.12 ; 18.45,18.29 18.18,18.56 v1(18.18,19.09) ; 20.63,11.65 20.63,10.06 v1(20.66,10.03) ; 10.37,11.87 10.37,10.52 v1(10.32,10.46) ; D16.3 23.99,9.41 v1(23.58,9) ; U6.3 15.29,15.57 v1(15.59,15.27) ; v1(13.74,4.57) 13.74,4.63 CN10.1 ; 24.32,27.43 24.32,27.92 23.88,28.36 ; 24.32,27.43 24.84,27.95 24.84,28.24 ; 24.32,27.43 v1(24.32,27.42) ; 24.32,27.43 24.29,27.4 ; v1(6.07,44.65) 6.07,43.88 6.13,43.82 ; 3.15,15.66 1.79,15.66 v1(1.76,15.63) ; 8.66,34.68 8.63,34.65 8.09,34.11 ; 4.74,5.56 3.73,4.55 3.73,1.92 3.85,2.04 8.45,2.04 ; 28.38,18.18 28.38,17.51 v1(28.36,17.49) ; 15.6,36.7 15.48,36.83 v1(15.48,37.48) ; 22.39,9.11 22.5,9 v1(23.58,9) ; v1(23.58,9) 23.58,10.03 C106.2 ; v1(7.07,18.15) 7.85,18.15 R28.1 ; U8.3 23.47,15.56 24.55,15.56 24.73,15.74 24.73,16.24 v1(24.85,16.37) ; v1(30.67,10.22) 30.61,10.28 C141.1 ; v1(32.69,24.13) 32.8,24.13 33.47,24.79 ; CN10.6 v1(15.14,1.94) ; 24.77,5.74 24.77,5.22 v1(23.66,4.11) CN11.6 v1(26.24,1.95) CN11.5 ; C86.2 13.87,9.73 v1(13.87,8.89) ; v1(13.87,8.89) 13.65,9.11 12.43,9.11 ; D6.3 8.08,9.69 v1(8.84,9.69) ; CN10.5 v1(17.81,1.94) ; C51.2 6.46,23.13 C59.2 6.45,22.3 v1(6.81,21.94)
  Top Layer w0.508: 46.81,35.47 46.83,35.47 46.85,35.49 ; 46.81,35.47 47.76,35.42 v1(47.78,35.4) ; 46.81,35.47 46.78,35.44 v1(45.95,35.44) 45.3,35.44 45.27,35.47 ; v1(46.21,42.98) 46.06,42.83 44.9,42.83 ; v1(47.48,36.96) 47.44,36.92 46.96,36.92 ; 51,33.15 50.77,33.38 50.37,33.38 ; 28.59,25.52 28.51,25.6 27.92,25.6 ; 43.05,40.62 42.71,40.95 42.28,40.95 ; 50.92,39.97 v1(50.97,39.93) 51.01,39.89 51.01,39.23 ; 12.46,45.43 14.49,45.43 14.55,45.48 ; v1(28.64,25.52) 28.66,25.54 29.47,25.54 29.24,25.31 v1(29.24,24.62) ; 40.82,38.27 40.91,38.27 41.58,37.6 ; 42.82,41.95 42.79,41.93 42.79,41.46 42.28,40.95 ; 57.32,31.02 57.24,31.1 56.51,31.1 ; 56.41,40.61 55.63,40.61 v1(55.6,40.64) 55.41,40.44 54.83,40.44 ; v1(31.03,35.69) 30.98,35.74 30.35,35.74 ; 45.35,28.13 45.86,27.62 45.86,27.35 ; 41.58,37.6 41.58,37.62 41.94,37.97 42.87,37.97 42.99,38.1 ; 41.58,37.6 41.58,37.51 ; 51.06,39.21 51.06,38.35 v1(51.32,38.1) ; v1(42.56,43.07) 42.71,42.92 42.71,42.16 ; 29,37.65 29.07,37.58 v1(30.53,37.58) ; 50.75,32.05 50.75,32.81 v1(51.08,33.15) ; 42.06,45.76 v1(40.67,45.76) ; 31.78,33.36 30.84,33.36 v1(30.75,33.44) ; 58.8,37.96 58.94,37.82 v1(58.94,37.35) ; 60.39,39.72 60.5,39.6 v1(60.5,38.28) ; 45.28,32.15 45.28,32.96 v1(45.3,32.97) ; v1(42.01,33.21) 42.01,33.97 41.88,34.1 ; 42.28,40.95 42.17,40.84 v1(41.97,40.84) ; v1(31.74,38.68) 31.69,38.64 31.69,37.98 ; 39.21,33.62 38.72,33.13 ; 37.59,33.37 38.33,33.37 38.62,33.07 ; 46.53,28.13 46.53,27.98 v1(45.92,27.38) ; v1(52.53,41.23) 52.52,41.21 52.52,40.34 ; 41.62,37.55 41.69,37.49 ; 52.04,34.58 52.04,33.75 v1(52.06,33.73) ; v1(14.12,46.99) 13.76,46.64 12.54,46.64 ; 14.53,45.5 14.56,45.48 v1(15.93,45.48) ; 50.38,40.94 50.97,40.35 ; 41.58,37.43 41.05,37.43 40.82,37.2 ; 58.32,36.12 58.37,36.17 59.74,36.17 ; 55.68,32.83 56.03,32.83 v1(56.44,33.24) 56.61,33.24 57.19,32.67 57.42,32.67 ; 38.72,33.07 v1(38.72,33.01)
  Bottom Layer w0.203: 20.62,45.09 21.12,45.58 v1(21.12,46.23) ; 16.19,44.42 15.68,43.92 v1(15.68,43.7) ; v1(21.25,38.29) 20.84,38.7 ; v1(5.37,25.26) 5.04,24.92 4.49,24.92 ; v1(31.83,30.12) 31.8,30.09 31.8,29.45 ; v1(4.11,34.54) 4.11,34.45 4.74,33.81 ; 15.1,30.62 15.1,32.02 v1(15.19,32.11) ; 35.2,16.3 34.95,16.54 34.21,16.54 ; 47.26,16.47 47.19,16.41 v1(46.75,16.41) ; 21.63,32.5 22.58,32.5 v1(22.81,32.27) ; 12.8,20.95 12.78,20.95 12.02,20.19 12.02,20.18 12,20.16 12,19.7 12.02,19.68 v1(12.02,19.39) ; v1(43.47,12.2) 43.64,12.36 43.64,13.36 ; 53.36,13.4 53.36,12.65 53.32,12.6 53.32,12.28 ; v1(33.45,12.17) 33.48,12.2 33.48,13.31 ; v1(1.64,36.81) 1.81,36.98 1.81,37.85 ; v1(12.06,41.6) 12.43,41.98 13.83,41.98 ; v1(15.68,43.7) 15.68,42.38 15.89,42.17 ; v1(15.68,43.7) 15.18,43.2 15.18,43.08 ; 16.57,28.7 17.12,28.7 v1(17.18,28.76) ; v1(36.65,18.19) 36.96,18.19 37.25,17.9 37.25,17.1 36.93,16.78 36.93,16.37 36.89,16.33 ; 20.71,35.43 20.52,35.43 v1(20.52,34.53) ; v1(1.07,39.42) 1.26,39.61 1.86,39.61 ; 44.94,16.51 45.26,16.51 v1(45.55,16.22) ; 1.67,44.83 1.67,46.21 v1(1.7,46.24) ; 19.94,26.93 20.63,26.93 v1(20.7,26.99) ; v1(0.87,32.5) 0.94,32.58 0.94,32.61 ; 56.41,16.24 56.9,16.24 57.21,16.54 ; 54.91,16.41 55.24,16.41 v1(55.31,16.33)
  Bottom Layer w0.254: v1(30.53,37.58) 30.34,37.4 30.34,37.39 30.18,37.23 30.17,37.23 29.82,36.88 29.41,36.88 ; C40.1 2.77,16.63 v1(1.76,15.63) ; v1(5.24,39.68) 5.51,39.95 5.51,40.81 ; 25.93,28.12 24.74,28.12 24.37,27.76 24.37,27.38 ; 21.25,38.31 21.65,38.31 21.86,38.1 ; C105.1 25.04,16.56 v1(24.85,16.37) ; 21.31,45.82 21.12,45.62 20.62,45.13 20.62,45.09 20.36,44.82 19.99,44.82 ; 21.31,45.82 21.31,45.66 ; 21.31,45.82 21.33,45.84 ; v1(59.17,45.06) 59.81,45.06 60.22,44.66 60.59,44.66 ; 26.76,16.53 27.71,17.49 v1(28.36,17.49) ; C38.1 7.07,18.14 v1(7.07,18.15) ; 15.17,45.34 15.17,45.38 ; v1(12.04,12.83) 12.66,12.83 CN4.1 ; 7.93,35.54 8.05,35.41 v1(8.05,34.08) ; C85.1 14.86,16.47 15.41,15.92 15.41,15.45 v1(15.59,15.27) 16.84,16.52 C84.1 ; 24.68,13.31 25.16,13.31 25.22,13.37
  Bottom Layer w0.508: v1(48.83,40.27) 48.62,40.47 48.62,41.45 ; v1(38.71,37.56) 39.35,37.56 39.36,37.57 ; 27.55,40.31 27.18,40.68 26.64,40.68 ; 53.41,44.76 53.36,44.81 53.36,46.73 53.34,46.76 v1(51.97,46.76) ; 36.43,41.65 36.46,41.65 ; 36.46,41.65 37.74,41.65 37.9,41.48 ; 36.46,41.65 37.18,40.92 v1(37.18,40.77) ; 36.46,41.65 36.44,41.66 ; v1(42.95,27.37) 42.8,27.37 42.36,26.93 ; 47.45,46.52 47.41,46.48 46.2,46.48 ; v1(36.85,43.46) 36.85,43.64 36.45,44.03 ; 36.14,36.63 36.73,36.63 v1(36.96,36.85) ; 29.08,24.01 29.08,24.47 v1(29.24,24.62) ; 42.94,32.52 42.51,32.94 42.51,32.98 42.28,33.21 v1(42.01,33.21) ; 60.62,47.02 60.39,46.8 59.16,46.8 v1(59.14,46.82) ; 34.93,40.64 34.68,40.64 34.15,40.12 ; 15.15,45.47 15.92,45.47 v1(15.93,45.48) ; 40.15,43.46 39.63,43.98 39.01,43.98 ; v1(39,43.95) 38.98,43.93 37.82,43.93 ; 37.95,36.73 37.14,36.73 36.98,36.89
  vias: v1(3.63,2.37) v1(3.58,1.12) v1(3.77,4.51) v1(4.45,13.2) v1(5.28,38.36) v1(6.24,2.02) v1(6.44,39.68) v1(6.47,38.37) v1(8.87,2.59) v1(8.87,1.12) v1(9.2,34.07) v1(9.36,45.79) v1(12.39,45.81) v1(13.71,2.46) v1(13.71,1.17) v1(17.22,39.21) v1(18.34,40.32) v1(18.9,2.5) v1(18.99,1.17) v1(19.64,41.42) v1(23.65,2.63) v1(23.65,1.3) v1(25.22,13.36) v1(28.93,2.63) v1(28.98,1.3) v1(33.65,9.01) v1(33.73,2.67) v1(33.71,1.24) v1(38.99,2.67) v1(39.01,1.26) v1(40.78,44.2) v1(40.78,42.54) v1(41.62,37.43) v1(43.59,8.92) v1(43.75,2.56) v1(43.69,1.19) v1(47.4,46.55) v1(48.96,35.95) v1(48.94,35.17) v1(48.95,2.59) v1(48.98,1.05) v1(49.93,35.93) v1(49.92,35.19) v1(53.32,12.2) v1(53.58,1.16) v1(53.6,2.35) v1(56.45,31.04) v1(56.43,16.23) v1(58.78,2.45) v1(58.84,1.05) v1(59.12,36.21)
VBAT: length 4.4
  Bottom Layer w0.508: 49.47,41.41 49.47,42.45 v1(49.12,42.8) ; v1(42.22,36.73) 42.09,36.73 41.54,36.18 ; 43.72,45.26 43.72,45.71 v1(43.79,45.78) 44.09,45.78 44.89,46.58
VBUS: length 36.9
  Top Layer w0.508: v1(29.74,41.36) 29.71,41.39 29.65,41.39 28.49,40.23 ; 33.39,40.2 33.53,40.06 34.14,40.06 34.73,39.47 35.57,39.47 36.16,40.06 v1(36.52,40.06) ; 28.43,40.26 28.43,38.7 26.43,36.69 v1(26.13,36.69) ; 28.49,40.23 28.45,40.19 ; 28.49,40.23 33.23,40.23 33.26,40.26 ; 28.49,40.23 28.47,40.23
  Bottom Layer w0.508: 27.44,36.89 27.24,36.69 v1(26.13,36.69) ; v1(36.52,40.06) 36.88,40.06 36.89,40.05 37.48,40.05 37.48,40.06 37.97,40.06 38.02,40.01 v1(39.69,40.01) ; 36.59,45.64 35.79,46.44 34.84,46.44 34.76,46.36 34.73,46.36 34.15,45.77 34.14,45.77 v1(29.74,41.36) ; 44.18,40.1 45.41,40.1 45.53,39.99 ; v1(39.69,40.01) 40.43,39.28 40.43,38.8 ; v1(39.69,40.01) 39.69,38.83 39.4,38.54 ; 45.61,40.06 v1(46.12,40.06) ; 43.7,41.42 43.91,41.21 43.91,39.93 ; 37.74,45.25 37.47,45.52 36.46,45.52 ; 37.86,45.25 37.92,45.31
  vias: v1(28.45,40.23) v1(33.26,40.21) v1(43.97,40.76)
VCC: length 20.3
  Top Layer w0.508: v1(44.91,45.43) 44.52,45.43 43.65,44.56 43.65,44.31 ; 42.66,44.39 42.91,44.64 42.91,45.72 ; 60.51,41.19 60.41,41.3 60.41,44.83 ; 60.44,41.14 59.96,40.65 58.67,40.65 58.74,40.59 58.69,40.63 v1(57.72,40.63) ; 42.91,45.72 42.92,46.83 v1(42.85,46.9) ; 42.91,45.72 42.91,45.77 ; 42.8,44.29 43.65,44.29 ; 30.12,34.65 29.57,34.65 v1(29.08,35.15) 29.08,36.57 29.12,36.61 ; 38.67,45.59 38.94,45.87 v1(38.94,46.86) ; 30.35,36.61 30.25,36.71 29.06,36.71
  Bottom Layer w0.508: 57.76,40.57 57.76,43.08 57.69,43.15
ADC1_AIN0: length 11.1
  Top Layer w0.203: 34.62,19.62 34.62,19.33 34.12,18.83 33.55,18.83 33.36,19.02 ; U30.6 38.49,22.67 37.87,22.06 34.99,22.06 34.04,21.1 34.04,20.23 34.57,19.7 ; 33.37,20.12 33.66,20.12 34.15,19.63 R134.2
ADC1_AIN1: length 11.1
  Top Layer w0.203: v1(32.42,21.85) 32.42,21.16 32.38,21.13 ; R135.2 32.38,21.13 ; 32.38,21.13 32.36,21.11 ; 32.38,21.13 32.38,19.07 32.32,19.01 ; v1(39.14,23.15) 39.14,23.16 U30.7
  Bottom Layer w0.203: v1(32.42,21.85) 33.91,23.35 38.94,23.35 v1(39.14,23.15)
ADC1_AIN2: length 21.6
  Top Layer w0.203: U30.8 39.88,23.78 39.88,22.8 38.51,21.43 38.51,19.33 37.99,18.81 37.99,18.77 37.66,18.44 37.66,18.4 v1(36.69,17.43) ; 35.41,9.51 35.35,9.57 35.35,10.05 34.83,10.57 34.83,10.67 34.76,10.74 ; 32.52,10.98 33.31,10.98 33.38,10.91 ; 32.46,11.04 32.45,11.05 ; 32.21,9.8 32.23,9.81 32.23,11.05 ; 33.45,10.89 33.47,10.91 34.29,10.91 34.49,10.71 34.78,10.71
  Bottom Layer w0.203: v1(36.69,17.43) 36.65,17.43 36.16,16.94 36.16,13.08 35.29,12.2 35.29,9.73 v1(35.56,9.47)
ADC1_AIN3: length 18
  Top Layer w0.203: 42.46,11.21 43.49,11.21 43.49,11.04 ; 44.33,10.98 43.47,10.98 ; U30.9 40.44,22.22 v1(40.44,22.22) ; 42.32,11.19 42.19,11.06 v1(41.8,11.06) ; 43.49,11.04 43.44,11 ; 43.49,11.04 43.49,11.05 ; 42.54,10.02 42.54,10.2 43.33,10.98 ; 44.65,10.69 44.33,11.02
  Bottom Layer w0.203: v1(41.8,11.06) 41.8,12.57 41.59,12.79 41.59,14.4 41.68,14.49 41.68,16.5 41.53,16.64 41.53,17.1 41.68,17.25 41.68,19.61 40.39,20.89 40.39,22.18 v1(40.44,22.22)
ADC1_AIN4: length 8.7
  Top Layer w0.203: 43.55,20.04 43.46,19.95 43.46,19.16 43.55,19.06 ; v1(44.8,20.76) 44.18,20.14 43.52,20.1 44.66,20.1 44.87,19.89 ; 44.74,19.78 44.86,19.9
  Bottom Layer w0.203: 44.79,20.88 44.67,20.88 43.16,22.4 41.34,22.4 v1(41.07,22.67)
ADC1_AIN5: length 8.7
  Top Layer w0.203: 42.47,21.19 41.77,20.49 41.68,20.49 ; v1(40.95,21.64) 41.02,21.7 41.02,21.95 41.18,22.11 41.47,22.11 41.59,21.98 41.85,21.98 41.96,22.09 41.96,22.4 41.74,22.62 U30.11 ; 42.22,19.04 42.14,19.04 41.68,19.49 41.68,20.49 ; v1(41.58,20.49) 41.68,20.49 ; 41.68,20.49 42.14,20.04 42.24,20.04 42.34,20.14 ; 41.58,20.5 41.68,20.5 ; 42.31,19.01 42.34,19.05
  Bottom Layer w0.203: v1(40.95,21.64) 40.95,21.12 v1(41.58,20.49)
ADC1_AIN6: length 16.9
  Top Layer w0.203: 55.03,19.06 55.03,19.07 C132.1 ; v1(52.16,21.95) 51.89,22.22 43.15,22.22 42.68,22.69 42.7,22.74 42.39,23.05 U30.12 ; 53.62,20.01 53.64,19.98 53.64,19.12 ; 53.62,20.01 53.63,20.02 C131.1 53.63,20.16 v1(54.15,20.68) ; 53.62,20.01 53.57,20.01
  Bottom Layer w0.203: v1(54.15,20.68) 53.35,20.68 52.16,21.87 v1(52.16,21.95)
ADC1_AIN7: length 16.9
  Top Layer w0.203: R174.2 53.54,21.11 52.63,20.2 ; C131.2 51.92,20.14 51.62,19.83 51.62,19.35 51.94,19.04 52.51,19.04 ; 53.55,21.35 53.74,21.55 53.74,22.23 53.36,22.61 43.36,22.61 43.04,22.94 U30.13
ADC1_CS: length 28.5
  Top Layer w0.203: 40.51,29.86 39.86,29.22 28.46,29.22 26.27,31.41 25.73,31.41 24.85,32.29 23.65,32.29 21.22,34.72
  Bottom Layer w0.203: 21.14,39.55 22.07,39.55 22.86,38.76 22.86,36.35 21.28,34.77 v1(21.28,34.75)
ADC1_DRDY: length 27.1
  Top Layer w0.203: 39.77,30.18 39.77,29.72 39.57,29.52 28.59,29.52 26.32,31.79 25.84,31.79 25.02,32.6 23.79,32.6 21.96,34.43 21.96,35.61 21.42,36.16
  Bottom Layer w0.203: v1(21.46,36.15) 22.01,36.15 22.54,36.68 22.54,38.46 21.95,39.06 21.14,39.06
ADC1_RST: length 1
  Top Layer w0.508: 43.75,30.8 43.95,30.6 44.65,30.6
ADC1_SYNC: length 0.7
  Top Layer w0.508: 44.49,23.86 44.39,23.95 43.82,23.95
ADC2_AIN0: length 25.5
  Top Layer w0.203: v1(16.9,25.29) 16.88,25.28 U20.6 ; v1(1.17,23.35) 1.17,23.08 0.69,22.6 0.69,21.48 0.99,21.17 1.17,21.17
  Top Layer w0.254: C27.1 1.74,21.01 1.74,21 R19.2
  Bottom Layer w0.203: v1(16.9,25.29) 16.71,25.48 16.71,25.59 16.36,25.95 11.14,25.95 9.43,27.66 4.84,27.66 1.16,23.98 v1(1.16,23.35)
ADC2_AIN1: length 25.4
  Top Layer w0.203: v1(0.96,26.24) 0.96,25.98 1.37,25.57 1.54,25.57 ; 1.72,22.85 1.32,22.45 1.32,22.37 ; U20.7 17.53,25.85 v1(17.53,25.85) ; 1.61,25.57 1.72,25.46 1.72,22.88 2.26,22.34 2.26,22.32
  Bottom Layer w0.203: v1(0.96,26.24) 2.93,26.24 4.7,28.01 9.58,28.01 11.29,26.3 16.5,26.3 16.96,25.85 v1(17.53,25.85)
ADC2_AIN2: length 46.6
  Top Layer w0.203: 2.27,11.13 1.34,11.13 v1(1.25,11.21) ; U20.8 18.11,23.86 18.11,25.68 v1(18.3,25.88)
  Top Layer w0.254: 2.42,11.09 C44.1 3.81,10.85 4.79,10.85 ; 2.34,9.98 2.34,11.16
  Top Layer w0.508: 1.03,9.87 1.15,9.98 2.24,9.98
  Bottom Layer w0.203: 1.27,11.23 0.4,12.1 0.4,29.06 1.68,30.34 6.04,30.34 6.05,30.35 9.54,30.35 12.34,27.55 16.62,27.55 v1(18.3,25.88)
ADC2_AIN3: length 25.4
  Top Layer w0.203: 12.42,11.11 12.39,11.09 v1(11.75,11.09) ; 18.82,23.44 18.84,23.45 18.84,24.8 19.09,25.05 19.85,25.05 v1(20.06,25.25)
  Top Layer w0.254: 12.43,9.98 12.42,9.99 12.42,11.16 12.53,11.05 13.64,11.05 13.88,10.81 14.83,10.81
  Bottom Layer w0.203: v1(20.06,25.25) 20.05,25.24 20.05,22.03 18.77,20.75 18.02,20.75 11.48,14.2 11.48,11.4 11.73,11.15
ADC2_AIN4: length 11.3
  Top Layer w0.203: 15.59,19.37 15.63,19.41 ; 14.35,20.47 14.43,20.47 14.8,20.1 14.8,19.7 14.94,19.55 15.36,19.55 R63.2 ; 14.24,19.36 14.24,19.36 C61.1 13.68,21.03 13.68,22.08 14.13,22.52 19.15,22.52 19.49,22.87 19.49,23.06 19.5,23.07
ADC2_AIN5: length 11.4
  Top Layer w0.203: R87.2 12.18,20.31 v1(12.56,19.93) ; v1(12.56,19.93) 12.59,19.93 C60.2 ; v1(12.56,19.93) 13.12,20.48 13.13,20.48 ; v1(19.2,21.97) 19.2,22.01 20.16,22.97 20.17,22.97
  Bottom Layer w0.203: v1(12.56,19.93) 14.08,19.93 15.52,21.37 18.6,21.37 v1(19.2,21.97)
ADC2_AIN6: length 8.2
  Top Layer w0.203: U20.12 20.78,22.62 21.46,21.95 23.11,21.95 24.21,20.86 24.21,20.55
  Top Layer w0.254: 24.33,19.34 24.33,20.51 C140.1 ; 24.33,19.34 C139.1 ; 24.33,19.34 24.18,19.34 24.17,19.33 ; 24.33,19.34 25.51,19.34
ADC2_AIN7: length 8.2
  Top Layer w0.203: v1(21.44,22.75) 21.43,22.77 U20.13 ; R181.2 21.74,20.43 22.29,20.98 22.29,21.15 ; 23.15,19.32 23.08,19.4 22.79,19.4 22.55,19.64 22.55,21 v1(22.36,21.19) 22.86,21.19 23.23,20.82 23.23,20.54
  Bottom Layer w0.203: v1(22.36,21.19) 21.44,22.1 v1(21.44,22.75)
ADC2_CS: length 7
  Top Layer w0.203: 18.84,30.97 18.84,31.86 v1(18.93,31.95)
  Bottom Layer w0.203: v1(18.93,31.95) 19.03,32.05 19.03,32.78 19.19,32.93 19.19,37.69 19.1,37.78
ADC2_DRDY: length 7.5
  Top Layer w0.203: v1(19.59,32.51) 18.7,32.51 18.37,32.18 18.37,31.56 18.18,31.37
  Bottom Layer w0.203: v1(19.59,32.51) 19.69,32.6 19.69,37.5 19.52,37.67
ADC2_RST: length 1.1
  Top Layer w0.203: 22.06,30.28 22.5,30.28 22.97,30.75
ADC2_SYNC: length 0.9
  Top Layer w0.203: 22.08,23.86 22.83,23.86 22.97,23.71
ANT: length 9.9
  Top Layer w0.152: 10.88,44.28 10.83,44.33 ; 7.08,37.06 8.09,37.06 arc(9.93,37.82) 10.69,39.66 10.69,44.34
CE1: length 18.8
  Top Layer w0.254: 5.53,7.47 5.54,7.49 v1(5.54,8.68) ; C31.2 2.51,17.59 3.15,16.96 3.94,16.96 5.87,15.03 5.87,13.68 7.32,12.23 v1(8.84,12.23) ; 5.55,7.48 5.55,6.09 5.75,5.88
  Bottom Layer w0.254: v1(8.84,12.23) 9,12.23 ; 9,12.23 CN3.4 ; 9,12.23 7.83,11.06 7.83,10.33 7.47,9.97 6.83,9.97 v1(5.54,8.68)
CE2: length 23.5
  Top Layer w0.254: C62.2 13.35,17.75 U6.1 14.82,16.87 16.18,15.51 16.18,13.8 16.6,13.37 16.6,13.01 17.12,12.49 18.52,12.49 v1(18.82,12.19) 18.82,11.17 19.71,10.28 19.71,9.27 18.82,8.38 17.62,8.38 v1(16.87,9.14) ; v1(15.52,9.78) 15.65,9.64 D14.2 15.65,5.92 CN10.2
  Bottom Layer w0.254: CN4.4 19.12,12.19 v1(18.82,12.19) ; v1(15.52,9.78) 16.23,9.78 v1(16.87,9.14)
CE3: length 17.9
  Top Layer w0.254: C103.2 23.43,17.78 U8.1 24.41,16.81 24.6,17.01 25.36,17.01 26.25,16.12 26.25,13.96 28.03,12.18 v1(28.92,12.18) ; 25.65,7.7 v1(25.65,8.57) ; 25.77,5.74 25.59,5.93 D16.2
  Bottom Layer w0.254: 28.86,12.18 28.86,11.79 v1(25.65,8.57)
CE4: length 20.8
  Top Layer w0.203: 38.84,12.17 36.06,12.17 35.46,12.78 35.46,13.32 ; 35.46,13.41 35.46,14.3 v1(35.3,14.46) ; 35.69,7.03 35.69,6.02 35.96,5.74 ; 35.68,7.36 35.68,8.51 v1(35.63,8.56) ; v1(32.18,16.81) 32.86,16.81 32.87,16.83 ; 32.87,16.83 32.59,17.11 32.59,17.87 32.55,17.91 ; 32.87,16.83 33.11,16.83 33.25,16.69 ; v1(38.95,12.07) 39.06,11.96 v1(39.06,10.32)
  Bottom Layer w0.203: v1(35.3,14.46) 35.1,14.66 33.52,14.66 32.18,16 v1(32.18,16.81) ; v1(39.06,10.32) 37.37,10.32 35.65,8.6
CE5: length 20.1
  Top Layer w0.203: 45.59,7.44 45.59,8.63 v1(45.58,8.64) ; 46.04,6.01 45.67,6.39 45.67,7.17 ; v1(49.2,12.2) 49.2,10.8 v1(48.82,10.41) ; 49.06,12.25 47.65,12.25 46.13,13.77 v1(46.13,14.36) ; 42.89,18.01 42.91,18 42.91,17.17 43.26,16.81 ; v1(42.09,16.87) 43.16,16.87
  Bottom Layer w0.203: v1(46.13,14.36) 45.92,14.58 44.39,14.58 v1(42.09,16.87) ; v1(45.58,8.64) 47.35,10.41 v1(48.82,10.41)
CE6: length 19.7
  Top Layer w0.203: 53.74,16.88 53.1,17.51 53.1,17.96 ; 55.29,7.42 55.29,8.28 v1(55.36,8.35) ; v1(58.99,10.27) 58.99,11.84 59.08,11.93 59.08,12.16 ; 59.08,12.16 57.42,12.16 56.37,13.22 56.37,13.72 v1(55.56,14.53) ; 59.08,12.16 v1(59.14,12.16) ; 55.57,6.91 55.57,5.58 55.61,5.54
  Bottom Layer w0.203: v1(58.99,10.27) 57.33,10.27 55.39,8.33 ; v1(53.25,17.37) 53.25,15.04 53.71,14.57 55.51,14.57 v1(55.56,14.53)
CH582_BOOT: length 15.3
  Top Layer w0.203: 3.84,33.65 3.5,33.99 3.5,35.22 3.89,35.61 ; 3.89,35.61 v1(3.91,35.63) ; 3.89,35.61 4.36,36.05 5.23,36.05 5.49,36.32 5.49,36.98 5.47,37 ; 3.55,45.71 3.52,45.68 v1(3.52,44.63)
  Bottom Layer w0.203: v1(3.52,44.63) 3.28,44.4 3.28,36.26 v1(3.91,35.63)
CH582_UART1_RX: length 2.6
  Top Layer w0.203: 4.18,42.08 4.66,42.08 5.07,41.67 5.07,41.15 5.08,41.14
  Bottom Layer w0.203: v1(4.13,42.08) 4.41,41.8 5.01,41.8
CH582_UART1_TX: length 4.1
  Top Layer w0.203: v1(3.84,43.09) 3.57,42.82 3.57,41.74 4.2,41.11 4.62,41.11
  Bottom Layer w0.203: 4.99,42.63 4.51,43.11 3.87,43.11 v1(3.84,43.09)
CH582_UART3_RX: length 16.5
  Top Layer w0.203: 8.1,38.21 8.14,38.25 8.52,38.25 8.9,38.62 8.9,40.23 v1(9.04,40.37)
  Bottom Layer w0.203: 9.05,40.37 9.14,40.37 9.34,40.57 15.6,40.57 15.71,40.69 ; 6.11,34.78 6.18,34.78 7.36,35.97 7.36,38.77 8.96,40.37 v1(9.04,40.37) 9.04,40.37
CH582_UART3_TX: length 16
  Top Layer w0.203: v1(8.13,40.94) 8.13,40.81 8.48,40.46 8.48,38.85 8.33,38.7 8.1,38.7
  Bottom Layer w0.203: 6.37,36.13 7.06,36.82 7.06,39.87 v1(8.13,40.94) 8.23,41.04 15.75,41.04 15.84,41.13
DAC_REF2V5: length 140.3
  Top Layer w0.381: 10.36,19.29 10.59,19.29 11.22,18.66 ; v1(19.71,19.8) 19.91,19.8 20.4,19.32 ; v1(39.21,19.27) 39.31,19.18 40.6,19.18 ; 30.48,18.98 30.48,19.43 v1(30.14,19.77) ; v1(59.51,19.41) 60.32,19.41 60.45,19.27 ; v1(49.51,19.12) 49.74,19.35 50.48,19.35
  Bottom Layer w0.381: 31.69,6.91 31.27,7.32 31.27,9.91 31.32,9.95 31.32,10.48 31.27,10.53 31.27,18.33 30.12,19.48 30.12,23.83 ; v1(59.51,19.41) 59.66,19.41 60,19.06 60,14.57 61.04,13.52 61.04,7.51 60.42,6.89 41.99,6.89 ; 41.99,6.89 13.32,6.89 11.03,9.18 11.03,18.54 11.14,18.65 ; 41.99,6.89 41.61,7.27 41.61,10.28 41.1,10.78 41.1,11.18 41.16,11.23 41.16,11.32 41.19,11.36 41.19,13.52 40.5,14.22 39.85,14.22 39.28,14.79 39.28,18.27 39.33,18.31 39.33,18.85 39.28,18.89 39.28,19.17 39.21,19.24 v1(39.21,19.27) ; 21.99,6.94 21.99,7.08 21.42,7.65 21.42,15.73 21.02,16.13 21.02,17.86 20.98,17.91 20.98,18.44 21.02,18.48 21.02,18.64 19.86,19.8 v1(19.71,19.8) ; v1(49.51,19.12) 49.5,19.11 49.5,15.43 51.24,13.69 51.24,11 51.75,10.49 51.75,7.49 51.2,6.94 51.2,6.92
  Bottom Layer w0.508: 31.44,24.85 30.56,23.97 30.18,23.97
  vias: v1(11.15,18.67)
DAC_SYNC#: length 19.7
  Bottom Layer w0.203: 31.52,28.74 31.21,28.74 24.93,35.02 24.93,40.58 23.39,42.12 22.1,42.12 21.65,41.67 20.86,41.67
DAC_VOUTA: length 68
  Top Layer w0.152: 40.96,14.95 40.96,15.46 41.51,16.02 41.51,19.27 40.27,20.51 39.09,20.51
  Top Layer w0.203: 52.7,21.23 51.15,21.23 50.56,20.64 ; 50.53,20.66 49.43,21.75 46.01,21.75 45.6,21.35 43.4,21.35 43.32,21.27 ; v1(39.07,20.49) 39.63,21.05 41.35,21.05 42.01,21.72 42.88,21.72 43.32,21.27 ; 43.3,21.25 43.32,21.27 ; v1(55.36,20.41) 56.61,21.66 v1(56.61,22.22) ; 50.53,20.66 50.53,20.65 51.21,19.96 51.21,19.26 51.54,18.93 51.54,16.17 50.55,15.17 50.55,15.14 ; v1(60.99,15.7) 60.99,15.53 60.61,15.14 ; 43.2,21.21 43.3,21.21 ; 33.22,21.15 33.22,21.21 33.78,21.77 ; v1(33.4,27.58) 31.97,27.58 31.82,27.44 31.82,23.62 v1(31.62,23.42)
  Top Layer w0.508: 33.44,27.62 33.44,28.28
  Bottom Layer w0.203: v1(55.36,20.41) 55.36,20.08 54.98,19.7 52.75,19.7 v1(51.22,21.23) ; v1(60.99,15.7) v1(60.99,19.97) ; v1(31.62,23.42) 30.73,22.53 30.73,21.78 31.68,20.84 32.91,20.84 33.8,21.72 ; v1(33.84,21.69) 36.04,19.49 36.4,19.49 36.47,19.56 37.66,19.56 38.59,20.49 v1(39.07,20.49) ; v1(56.61,22.22) 56.61,22.01 58.59,20.02 60.96,20.02 ; v1(33.4,27.58) 33.28,27.46 32.17,27.46
